# EAGLE design EM7SEGClk (EAGLE 9.0.1)
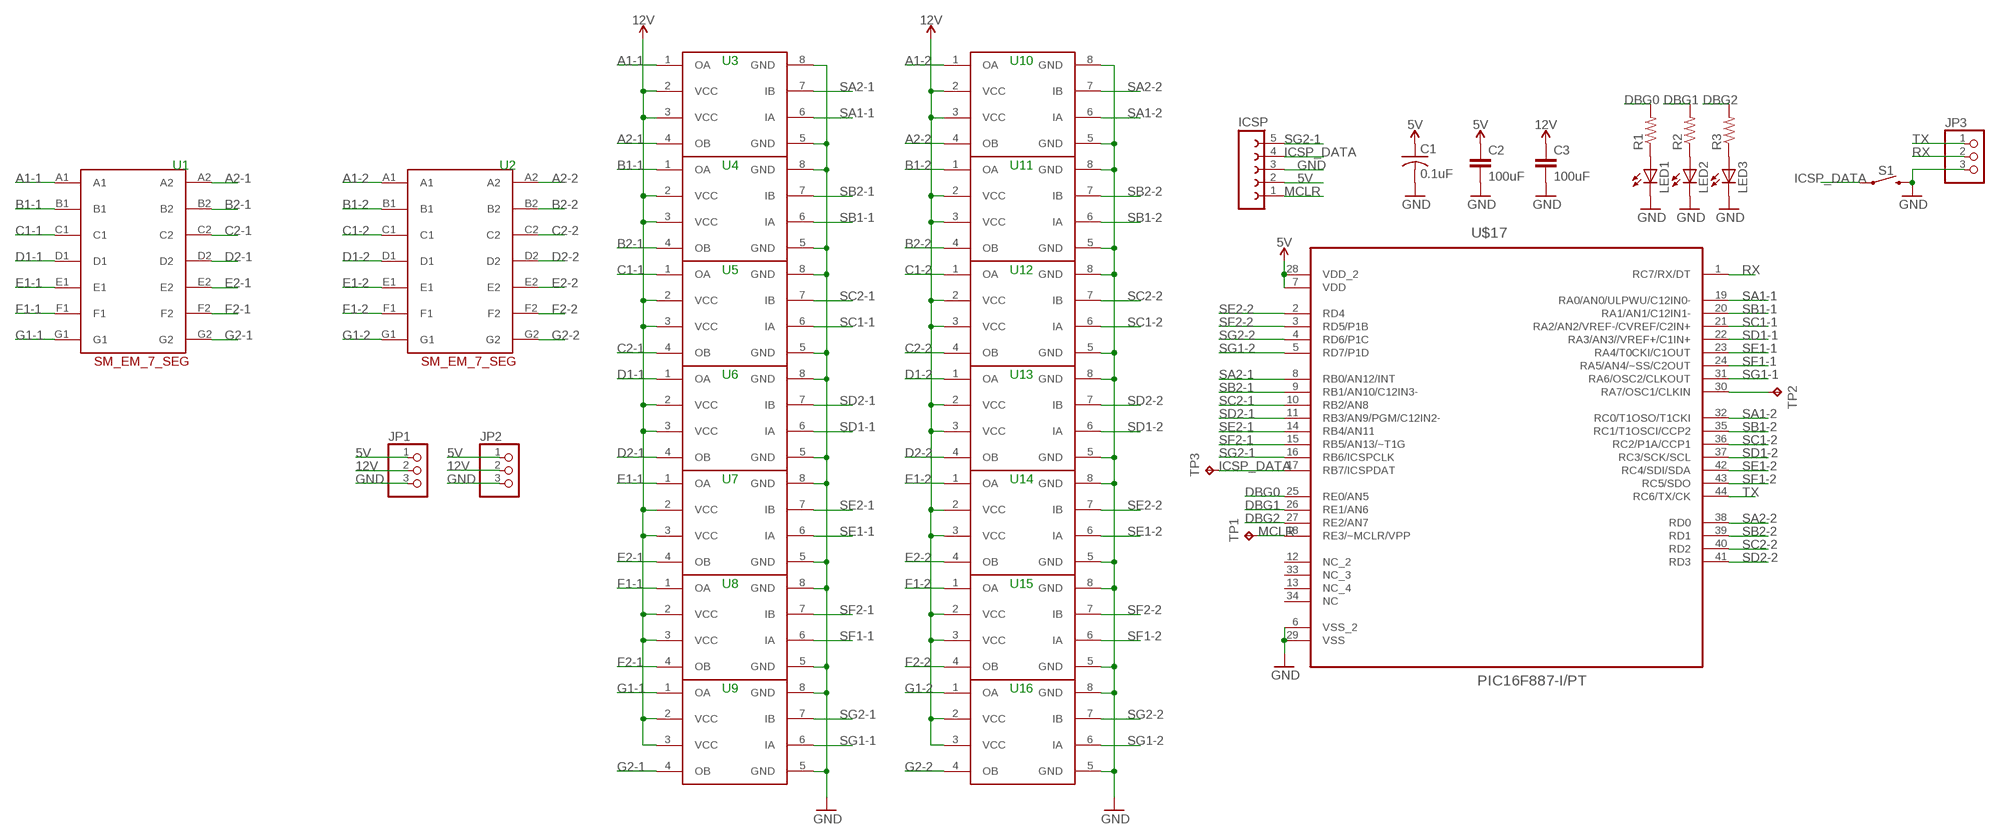
[diagram p0: schematic, sheet 1]

## Parts
C1  0.1uF  C-USC0805  [C0805]
C2  100uF  C5/2.5  [C5B2.5]
C3  100uF  C5/2.5  [C5B2.5]
ICSP  FE05-1  [FE05-1]
JP1  PINHD-1X3CB  [1X03-CLEANBIG]
JP2  PINHD-1X3CB  [1X03-CLEANBIG]
JP3  PINHD-1X3CB  [1X03-CLEANBIG]
LED1  LEDCHIPLED_0805  [CHIPLED_0805]
LED2  LEDCHIPLED_0805  [CHIPLED_0805]
LED3  LEDCHIPLED_0805  [CHIPLED_0805]
R1  R-US_M0805  [M0805]
R2  R-US_M0805  [M0805]
R3  R-US_M0805  [M0805]
S1  MOMENTARY-SWITCH-SPST-PTH-6.0MM  [TACTILE_SWITCH_PTH_6.0MM]
TP1  TPTP16R  [TP16R]
TP2  TPTP16R  [TP16R]
TP3  TPTP16R  [TP16R]
U$1  ELECTROMECHANICAL_7_SEG  [EM_7_SEG]
U$2  ELECTROMECHANICAL_7_SEG  [EM_7_SEG]
U$3  L9110SOP8  [SO8]
U$4  L9110SOP8  [SO8]
U$5  L9110SOP8  [SO8]
U$6  L9110SOP8  [SO8]
U$7  L9110SOP8  [SO8]
U$8  L9110SOP8  [SO8]
U$9  L9110SOP8  [SO8]
U$10  L9110SOP8  [SO8]
U$14  L9110SOP8  [SO8]
U$15  L9110SOP8  [SO8]
U$16  L9110SOP8  [SO8]
U$17  PIC16F887-I/PT  [QFP80P1200X1200X120-44N]
U$140  L9110SOP8  [SO8]
U$150  L9110SOP8  [SO8]
U$160  L9110SOP8  [SO8]

## Nets
5V: C1.1 C2.1 ICSP.2 JP1.1 JP2.1 U$17.7(VDD) U$17.28(VDD_2)
12V: C3.1 JP1.2 JP2.2 U$3.2(VCC) U$3.3(VCC) U$4.2(VCC) U$4.3(VCC) U$5.2(VCC) U$5.3(VCC) U$6.2(VCC) U$6.3(VCC) U$7.2(VCC) U$7.3(VCC) U$8.2(VCC) U$8.3(VCC) U$9.2(VCC) U$9.3(VCC) U$10.2(VCC) U$10.3(VCC) U$14.2(VCC) U$14.3(VCC) U$15.2(VCC) U$15.3(VCC) U$16.2(VCC) U$16.3(VCC) U$140.2(VCC) U$140.3(VCC) U$150.2(VCC) U$150.3(VCC) U$160.2(VCC) U$160.3(VCC)
A1-1: U$1.A1 U$3.1(OA)
A1-2: U$2.A1 U$10.1(OA)
A2-1: U$1.A2 U$3.4(OB)
A2-2: U$2.A2 U$10.4(OB)
B1-1: U$1.B1 U$4.1(OA)
B1-2: U$2.B1 U$140.1(OA)
B2-1: U$1.B2 U$4.4(OB)
B2-2: U$2.B2 U$140.4(OB)
C1-1: U$1.C1 U$5.1(OA)
C1-2: U$2.C1 U$150.1(OA)
C2-1: U$1.C2 U$5.4(OB)
C2-2: U$2.C2 U$150.4(OB)
D1-1: U$1.D1 U$6.1(OA)
D1-2: U$2.D1 U$160.1(OA)
D2-1: U$1.D2 U$6.4(OB)
D2-2: U$2.D2 U$160.4(OB)
DBG0: R1.2 U$17.25(RE0/AN5)
DBG1: R2.2 U$17.26(RE1/AN6)
DBG2: R3.2 U$17.27(RE2/AN7)
E1-1: U$1.E1 U$7.1(OA)
E1-2: U$2.E1 U$14.1(OA)
E2-1: U$1.E2 U$7.4(OB)
E2-2: U$2.E2 U$14.4(OB)
F1-1: U$1.F1 U$8.1(OA)
F1-2: U$2.F1 U$15.1(OA)
F2-1: U$1.F2 U$8.4(OB)
F2-2: U$2.F2 U$15.4(OB)
G1-1: U$1.G1 U$9.1(OA)
G1-2: U$2.G1 U$16.1(OA)
G2-1: U$1.G2 U$9.4(OB)
G2-2: U$2.G2 U$16.4(OB)
GND: C1.2 C2.2 C3.2 ICSP.3 JP1.3 JP2.3 JP3.3 LED1.C LED2.C LED3.C S1.3 U$3.5(GND) U$3.8(GND) U$4.5(GND) U$4.8(GND) U$5.5(GND) U$5.8(GND) U$6.5(GND) U$6.8(GND) U$7.5(GND) U$7.8(GND) U$8.5(GND) U$8.8(GND) U$9.5(GND) U$9.8(GND) U$10.5(GND) U$10.8(GND) U$14.5(GND) U$14.8(GND) U$15.5(GND) U$15.8(GND) U$16.5(GND) U$16.8(GND) U$17.6(VSS_2) U$17.29(VSS) U$140.5(GND) U$140.8(GND) U$150.5(GND) U$150.8(GND) U$160.5(GND) U$160.8(GND)
ICSP_DATA: ICSP.4 S1.1 TP3.TP U$17.17(RB7/ICSPDAT)
MCLR: ICSP.1 TP1.TP U$17.18(RE3/~MCLR/VPP)
N$1: LED1.A R1.1
N$2: LED2.A R2.1
N$3: LED3.A R3.1
N$4: TP2.TP U$17.30(RA7/OSC1/CLKIN)
RX: JP3.2 U$17.1(RC7/RX/DT)
SA1-1: U$3.6(IA) U$17.19(RA0/AN0/ULPWU/C12IN0-)
SA1-2: U$10.6(IA) U$17.32(RC0/T1OSO/T1CKI)
SA2-1: U$3.7(IB) U$17.8(RB0/AN12/INT)
SA2-2: U$10.7(IB) U$17.38(RD0)
SB1-1: U$4.6(IA) U$17.20(RA1/AN1/C12IN1-)
SB1-2: U$17.35(RC1/T1OSCI/CCP2) U$140.6(IA)
SB2-1: U$4.7(IB) U$17.9(RB1/AN10/C12IN3-)
SB2-2: U$17.39(RD1) U$140.7(IB)
SC1-1: U$5.6(IA) U$17.21(RA2/AN2/VREF-/CVREF/C2IN+)
SC1-2: U$17.36(RC2/P1A/CCP1) U$150.6(IA)
SC2-1: U$5.7(IB) U$17.10(RB2/AN8)
SC2-2: U$17.40(RD2) U$150.7(IB)
SD1-1: U$6.6(IA) U$17.22(RA3/AN3//VREF+/C1IN+)
SD1-2: U$17.37(RC3/SCK/SCL) U$160.6(IA)
SD2-1: U$6.7(IB) U$17.11(RB3/AN9/PGM/C12IN2-)
SD2-2: U$17.41(RD3) U$160.7(IB)
SE1-1: U$7.6(IA) U$17.23(RA4/T0CKI/C1OUT)
SE1-2: U$14.6(IA) U$17.42(RC4/SDI/SDA)
SE2-1: U$7.7(IB) U$17.14(RB4/AN11)
SE2-2: U$14.7(IB) U$17.2(RD4)
SF1-1: U$8.6(IA) U$17.24(RA5/AN4/~SS/C2OUT)
SF1-2: U$15.6(IA) U$17.43(RC5/SDO)
SF2-1: U$8.7(IB) U$17.15(RB5/AN13/~T1G)
SF2-2: U$15.7(IB) U$17.3(RD5/P1B)
SG1-1: U$9.6(IA) U$17.31(RA6/OSC2/CLKOUT)
SG1-2: U$16.6(IA) U$17.5(RD7/P1D)
SG2-1: ICSP.5 U$9.7(IB) U$17.16(RB6/ICSPCLK)
SG2-2: U$16.7(IB) U$17.4(RD6/P1C)
TX: JP3.1 U$17.44(RC6/TX/CK)
Unconnected: U$17.12(NC_2) U$17.13(NC_4) U$17.33(NC_3) U$17.34(NC)

## Notes on the sheet
- U3 | U10
- U1 | U2 | U4 | U11
- U5 | U12
- U6 | U13
- U7 | U14
- U8 | U15
- U9 | U16

## Library data of the parts
C1 = adafruit:C-US: CAPACITOR, American symbol
C2 C3 = capacitor-wima:C: CAPACITOR naming: grid - package width
ICSP = con-lsta:FE05-1: FEMALE HEADER; OC_FARNELL: unknown; OC_NEWARK: unknown
JP1-JP3 = adafruit:PINHD-1X3: PIN HEADER
LED1-LED3 = adafruit:LED: LED OSRAM: - CHIPLED LG R971, LG N971, LY N971, LG Q971, LY Q971, LO R971, LY R971 LH N974, LH R974 LS Q976, LO Q976, LY Q976 LO Q996 - Hyper CHIPLED LW Q18S LB Q993, LB Q99A, LB R99A - SideLED LS A670, LO A670, LY A670, LG A670, LP A670 LB A673, LV A673, LT A673, LW A673 LH A674 LY A675 LS A676, LA A676, LO A676, LY A676, LW A676 LS A679, LY A679, LG A679 - Hyper Micro SIDELED® LS Y876, LA Y876, LO Y876, LY Y876 LT Y87S - SmartLED LW L88C, LW L88S LB L89C, LB L89S, LG L890 LS L89K, LO L89K, LY L89K LS L896, LA L896, LO L896, LY L896 - TOPLED LS T670, LO T670, LY T670, LG T670, LP T670 LSG T670, LSP T670, LSY T670, LOP T670, LYG T670 LG T671, LOG T671, LSG T671 LB T673, LV T673, LT T673, LW T673 LH T674 LS T676, LA T676, LO T676, LY T676, LB T676, LH T676, LSB T676, LW T676 LB T67C, LV T67C, LT T67C, LS T67K, LO T67K, LY T67K, LW E67C LS E67B, LA E67B, LO E67B, LY E67B, LB E67C, LV E67C, LT E67C LW T67C LS T679, LY T679, LG T679 LS T770, LO T770, LY T770, LG T770, LP T770 LB T773, LV T773, LT T773, LW T773 LH T774 LS E675, LA E675, LY E675, LS T675 LS T776, LA T776, LO T776, LY T776, LB T776 LHGB T686 LT T68C, LB T68C - Hyper Mini TOPLED® LB M676 - Mini TOPLED Santana® LG M470 LS M47K, LO M47K, LY M47K Source: http://www.osram.convergy.de/
R1-R3 = adafruit:R-US_: RESISTOR, American symbol
S1 = SparkFun-Switches:MOMENTARY-SWITCH-SPST: Momentary Switch (Pushbutton) - SPST Normally-open (NO) SPST momentary switches (buttons, pushbuttons). Variants PTH-12MM - 12mm square, through-hole Momentary Pushbutton Switch - 12mm Square <https://www.sparkfun.com/products/9190> (COM-09190) PTH-6.0MM, PTH-6.0MM-KIT - 6.0mm square, through-hole Mini Pushbutton Switch <https://www.sparkfun.com/products/97> (COM-00097) KIT package intended for soldering kit's - only one side of pads' copper is exposed. PTH-RIGHT-ANGLE-KIT - Right-angle, through-hole Right Angle Tactile Button <https://www.sparkfun.com/products/10791> - Used on SparkFun BigTime Watch Kit <https://www.sparkfun.com/products/11734> SMD-12MM - 12mm square, surface-mount Tactile Button - SMD (12mm) <https://www.sparkfun.com/products/12993> (COM-12993) Used on SparkFun PicoBoard <https://www.sparkfun.com/products/11888> SMD-4.5MM - 4.5mm Square Trackball Switch Used on SparkFun Blackberry Trackballer Breakout <https://www.sparkfun.com/products/13169> SMD-4.6MMX2.8MM - 4.60mm x 2.80mm, surface mount Used on SparkFun SAMD21 Mini Breakout <https://www.sparkfun.com/products/13664> SMD-5.2MM, SMD-5.2-REDUNDANT - 5.2mm square, surface-mount Mini Pushbutton Switch - SMD <https://www.sparkfun.com/products/8720> (COM-08720) Used on Arduino Pro Mini <https://www.sparkfun.com/products/11114> REDUNDANT package connects both switch circuits together SMD-6.0X3.5MM - 6.0 x 3.5mm, surface mount Momentary Reset Switch SMD <https://www.sparkfun.com/products/8229> (COM-08229) SMD-6.2MM-TALL - 6.2mm square, surface mount Tactile Button - SMD (6mm) <https://www.sparkfun.com/products/12992> Used on SparkFun Digital Sandbox <https://www.sparkfun.com/products/12651> SMD-RIGHT-ANGLE - Right-angle, surface mount Used on SparkFun Block for Intel® Edison - Arduino <https://www.sparkfun.com/products/13036>; PROD_ID: SWCH-08441; SF_SKU: COM-00097
TP1-TP3 = BeagleBone_Blue_R3:TP: Test pad
U$1 U$2 = sjm4306-custom:ELECTROMECHANICAL_7_SEG
U$3-U$10 U$14-U$16 U$140 U$150 U$160 = sjm4306-custom:L9110
U$17 = Microchip_By_element14_Batch_1:PIC16F887-I/PT: 8-Bit CMOS Microcontrollers; MPN: PIC16F887-I/PT; OC_FARNELL: 1439542; OC_NEWARK: 74K8587; PACKAGE: QFP-44; SUPPLIER: Microchip

## Board
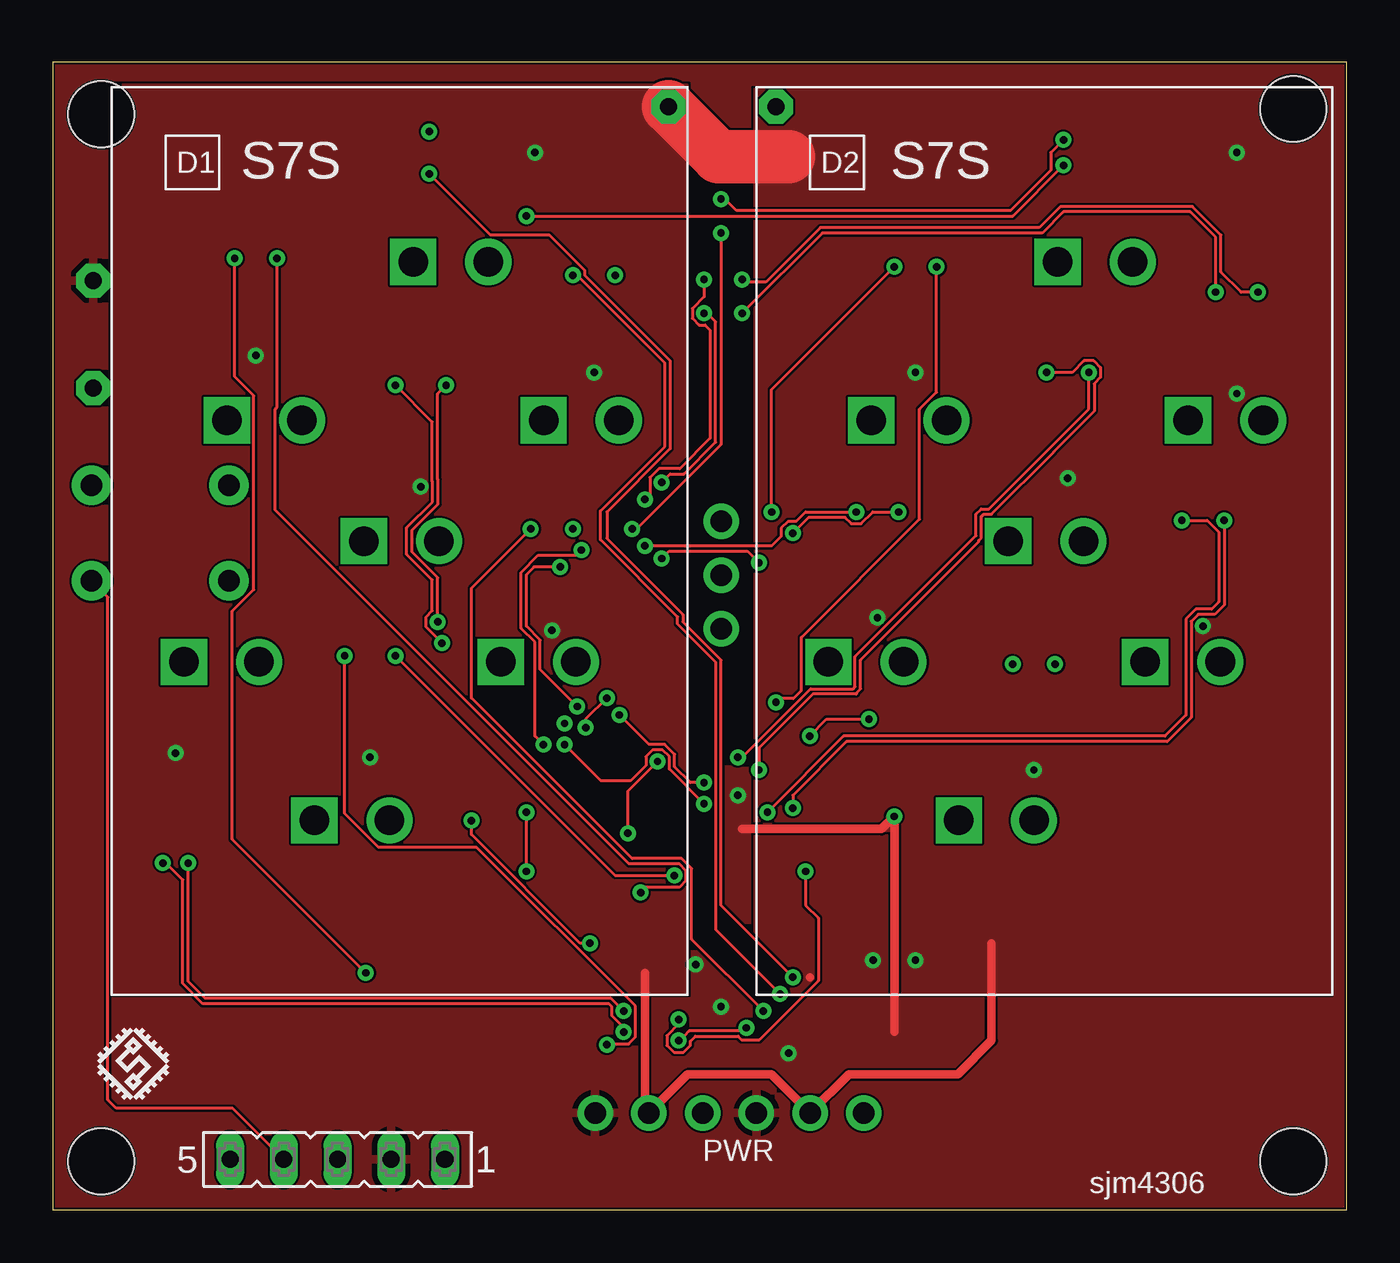
[diagram p1: board, top side]
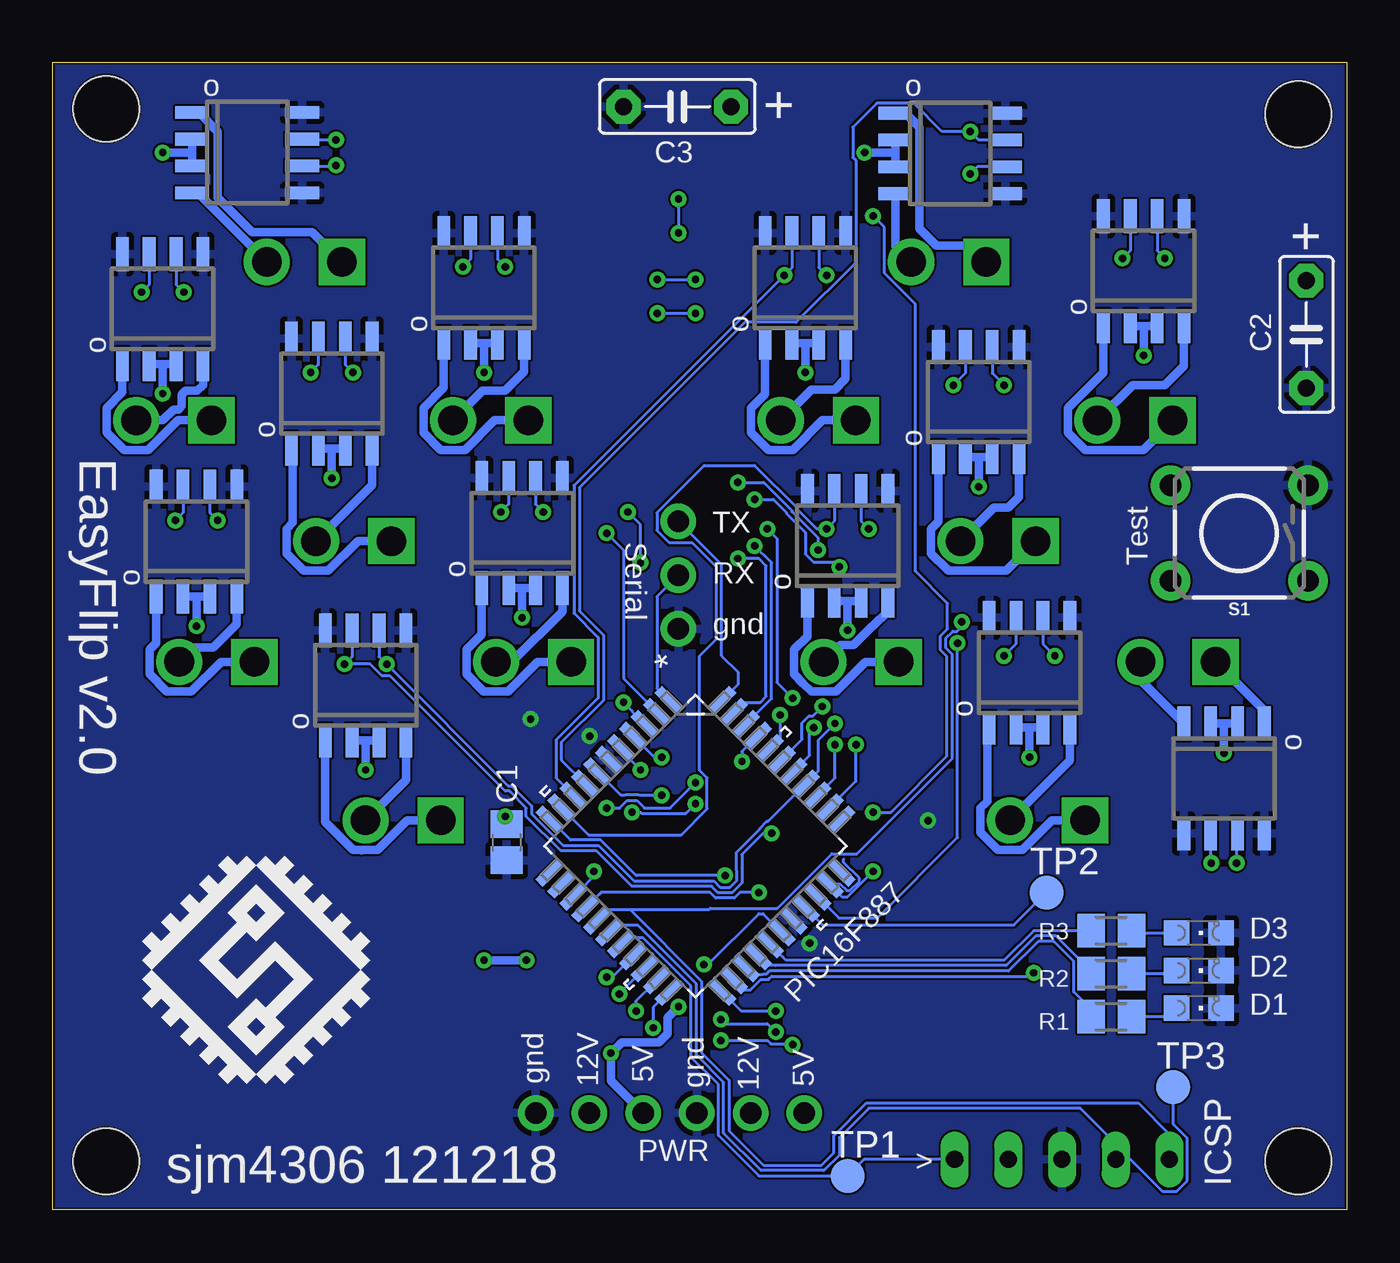
[diagram p2: board, bottom side, seen from below]

Size 61.19 x 54.28 mm. Coordinates in mm from the lower left corner, seen from the top.
Outline: 0,0 61.19,0 61.19,54.28 0,54.28 0,0
Copper layers (1*16): Top 0.035mm / dielectric 1.5mm / Bottom 0.035mm
Design rules "default *": minimum track width 6mil, minimum drill 0.35mm, track to track 4mil, track to pad 4mil, pad to pad 4mil, via to via 4mil, smd to smd 4mil, copper to edge 4mil, drill to drill 6mil, minimum pad ring 10mil, minimum via ring 8mil, stop-mask expansion 4mil, vias tented up to drill 15mil, thermal gap 10mil
Holes 3.1 mm at 58.67,52.07 2.29,51.82 58.67,2.29 2.29,2.29

### Footprints (pad centres in the part's own frame; a part is rotated, then mirrored left to right if it is on the bottom)
C0805 = smd 1.3 x 1.5: 1 -0.85,0; 2 0.85,0
C5B2.5 = drill 0.813 pad 1.6 octagon: 1 -2.54,0; 2 2.54,0
FE05-1 = drill 0.813 long: 1 -5.08,0; 2 -2.54,0; 3 0,0; 4 2.54,0; 5 5.08,0
1X03-CLEANBIG = drill 1.016 pad 1.676: 1 -2.54,0; 2 0,0; 3 2.54,0
CHIPLED_0805 = smd 1.2 x 1.2: A 0,-1.05; C 0,1.05
M0805 = smd 1.3 x 1.6: 1 -0.95,0; 2 0.95,0
TACTILE_SWITCH_PTH_6.0MM = drill 1.016 pad 1.88: 1 -3.251,2.261; 2 3.251,2.261; 3 -3.251,-2.261; 4 3.251,-2.261
TP16R = smd 1.6 x 1.6: TP 0,0
EM_7_SEG = drill 1.397 pad 2.184 square: A1 14.249,34.671; B1 20.422,27.178; C1 18.39,15.748; D1 9.576,8.255; E1 3.404,15.748; F1 5.436,27.178; G1 11.913,21.463 | drill 1.397 pad 2.184: A2 17.805,34.671; B2 23.978,27.178; C2 21.946,15.748; D2 13.132,8.255; E2 6.96,15.748; F2 8.992,27.178; G2 15.469,21.463
SO8 = smd 0.6 x 1.6: 1 -1.905,-2.6; 2 -0.635,-2.6; 3 0.635,-2.6; 4 1.905,-2.6; 5 1.905,2.6; 6 0.635,2.6; 7 -0.635,2.6; 8 -1.905,2.6
QFP80P1200X1200X120-44N = smd 1.473 x 0.483: 1 -5.74,3.988; 2 -5.74,3.2; 3 -5.74,2.388; 4 -5.74,1.6; 5 -5.74,0.787; 6 -5.74,0; 7 -5.74,-0.787; 8 -5.74,-1.6; 9 -5.74,-2.388; 10 -5.74,-3.2; 11 -5.74,-3.988; 23 5.74,-3.988; 24 5.74,-3.2; 25 5.74,-2.388; 26 5.74,-1.6; 27 5.74,-0.787; 28 5.74,0; 29 5.74,0.787; 30 5.74,1.6; 31 5.74,2.388; 32 5.74,3.2; 33 5.74,3.988 | smd 0.483 x 1.473: 12 -3.988,-5.74; 13 -3.2,-5.74; 14 -2.388,-5.74; 15 -1.6,-5.74; 16 -0.787,-5.74; 17 0,-5.74; 18 0.787,-5.74; 19 1.6,-5.74; 20 2.388,-5.74; 21 3.2,-5.74; 22 3.988,-5.74; 34 3.988,5.74; 35 3.2,5.74; 36 2.388,5.74; 37 1.6,5.74; 38 0.787,5.74; 39 0,5.74; 40 -0.787,5.74; 41 -1.6,5.74; 42 -2.388,5.74; 43 -3.2,5.74; 44 -3.988,5.74

### Placement (x,y rotation side)
C1  39.73,17.37 270 bottom
C2  1.9,41.4 270 bottom
C3  31.66,52.18 180 bottom
ICSP  13.46,2.38 180 top
JP1  35.81,4.57 0 top
JP2  28.19,4.57 0 top
JP3  31.6,30.01 270 top
LED1  7,9.53 270 bottom
LED2  7,11.31 270 bottom
LED3  7,13.09 270 bottom
R1  11.13,9.13 180 bottom
R2  11.13,11.17 180 bottom
R3  11.13,13.2 180 bottom
S1  5.08,32 180 bottom
TP1  23.6,1.6 0 bottom
TP2  14.2,15 0 bottom
TP3  8.2,5.8 0 bottom
U$1  2.79,10.16 0 top
U$2  33.27,10.16 0 top
U$3  18.75,49.96 270 bottom
U$4  25.6,43.6 0 bottom
U$5  23.6,31.4 0 bottom
U$6  15,25.4 0 bottom
U$7  5.8,20.4 180 bottom
U$8  9.6,44.4 0 bottom
U$9  17.4,38.2 0 bottom
U$10  52,50 270 bottom
U$11  [SJM4306_LOGO_MEDIUM]  51.28,11.33 0 bottom
U$13  [SJM4306_LOGO_SMALL]  3.81,6.86 0 top
U$14  39,32 0 bottom
U$15  40.8,43.6 0 bottom
U$16  48,38.6 0 bottom
U$17  30.8,17.2 315 bottom
U$140  56,42.6 0 bottom
U$150  54.4,31.6 0 bottom
U$160  46.4,24.8 0 bottom

### Tracks (layer width: path | path; a pad name or v marks a point on that pad's centre or on a via)
5V  (via drill 0.35)
  Top 0.406: 32.6,18 39.2,18 v39.8,18.6 39.8,8.4
  Bottom 0.152: U$17.28 27.6,14 27.8,14 30.2,11.6 v30.4,11.6 | C1.1 39.8,18.29 v39.8,18.6 | U$17.28 | v32.4,19.6 33.45,19.6 33.46,19.61 34.14,19.61 34.15,19.6 34.31,19.6 34.36,19.64 | 34.36,19.64 U$17.7 34.36,19.64 | 34.36,19.64
  Bottom 0.406: JP1.1 34.8,6.1 v34.8,7.4 34.28,7.92 32.52,7.92 32.12,8.32 32.12,9.08 v31.6,9.6
  pour Top (rank 2): -3.56,-3.81 -3.56,59.69 66.29,59.69 66.29,-3.81
12V  (via drill 0.35)
  Top 0.406: 35.81,10.99 35.8,11 | 28,11.2 28,4.77 JP2.2 30.02,6.4 33.99,6.4 JP1.2 37.64,6.4 42.8,6.4 44.4,8 44.4,12.6
  Top 2.54: C3.1 31.49,49.8 34.8,49.8
  Bottom 0.406: U$7.2 5.8,23 | 5.8,23 U$7.3 | 5.8,23 v5.8,21.6 | U$6.2 15,22.8 | 15,22.8 U$6.3 | 15,22.8 v15,21.4 | U$3.2 21.35,50 | 21.35,50 U$3.3 | U$10.2 54.6,50 | 54.6,50 U$10.3 | 54.6,50 v56,50 | U$15.2 40.8,41 | 40.8,41 U$15.3 | v40.8,39.6 40.8,41 | U$140.3 56,40 | 56,40 U$140.2 | v56,38.6 56,40 | U$16.2 48,36 | 48,36 U$16.3 | v48,34.6 48,36 | U$150.2 54.4,29 | 54.4,29 U$150.3 | v54.4,27.6 54.4,29 | U$14.2 39,29.4 | 39,29.4 U$14.3 | v39,28 39,29.4 | U$160.2 46.4,22.2 | 46.4,22.2 U$160.3 | v46.4,20.8 46.4,22.2 | U$5.2 23.6,28.8 | 23.6,28.8 U$5.3 | v23.6,27.4 23.6,28.8 | U$8.2 9.6,41.8 | 9.6,41.8 U$8.3 | v9.6,40.4 9.6,41.8 | v22.8,50 21.35,50 | U$4.3 25.6,41 | 25.6,41 U$4.2 | v25.6,39.6 25.6,41 | U$9.2 17.4,35.6 | 17.4,35.6 U$9.3 | v17.4,34.2 17.4,35.6 | v38.8,11.8 v40.8,11.8
  pour Top: 2.8,10.4 2.8,53.2 30,53.2 30,10.2 2.8,10.2
  pour Top: 33.2,10.2 33.2,53 60.4,53 60.4,10.2 60,10.2
A1-1
  Bottom 0.406: U$1.A1 17.81,45.6 19.39,45.6 20.2,46.41 20.2,51.2 20.86,51.87 U$3.1
A1-2
  Bottom 0.406: U$2.A1 48.92,46.23 51.76,46.23 53.4,47.87 53.4,51 54.3,51.91 U$10.1
A2-1
  Bottom 0.406: U$1.A2 21.35,45.58 U$3.4
A2-2
  Bottom 0.406: U$2.A2 54.34,48.09 U$10.4
B1-1
  Bottom 0.406: U$1.B1 24.8,37.34 26.19,35.94 27.35,35.94 28.17,36.76 28.17,37.92 27.5,38.58 U$4.1
B1-2
  Bottom 0.406: U$140.1 57.91,38.66 58.65,37.92 58.65,36.76 57.83,35.94 56.67,35.94 55.28,37.34 U$2.B1
B2-1
  Bottom 0.406: U$1.B2 25.31,38.8 24.2,38.8 23.7,39.3 U$4.4
B2-2
  Bottom 0.406: U$2.B2 55.99,37.34 55.49,37.85 55.25,37.85 55.09,38 55.09,38.56 54.91,38.73 54.36,38.73 54.09,39 U$140.4
C1-1
  Bottom 0.406: U$1.C1 22.76,25.91 24.16,24.51 25.32,24.51 25.7,24.9 26.14,25.33 26.14,26.49 25.5,27.12 U$5.1
C1-2
  Bottom 0.406: U$2.C1 53.24,25.91 54.64,24.51 55.8,24.51 56.62,25.33 56.62,26.49 56.3,26.8 U$150.1
C2-1
  Bottom 0.406: U$1.C2 23.93,26.72 23.32,26.72 22.43,27.6 22.4,27.6 21.7,28.3 U$5.4
C2-2
  Bottom 0.406: U$2.C2 54.53,26.6 53.6,26.6 52.49,27.7 U$150.4
D1-1
  Bottom 0.406: U$1.D1 13.95,18.41 15.35,17.02 16.5,17.02 17.32,17.84 17.32,18.99 17,19.32 17,22.7 U$6.1
D1-2
  Bottom 0.406: U$2.D1 44.43,18.41 45.83,17.02 46.58,17.02 46.6,17 46.62,17.02 46.98,17.02 48.3,18.34 U$160.1
D2-1
  Bottom 0.406: U$1.D2 13.1,21.25 U$6.4
D2-2
  Bottom 0.406: U$2.D2 44.49,20.33 U$160.4
DBG0
  Bottom 0.152: R1.2 12.08,9.46 12.91,10.29 12.91,11.75 13.85,12.69 14.59,12.69 15.99,11.29 27.3,11.29 27.45,11.14 27.6,11.14 28,11.14 28.12,11.14 | 28.12,11.14 U$17.25 28.12,11.14 | 28.12,11.14
DBG1
  Bottom 0.152: R2.2 12.08,11.28 13.74,12.94 14.7,12.94 16.09,11.55 27,11.55 27.41,11.55 | 27.41,11.55 U$17.26 27.41,11.55 | 27.41,11.55
DBG2
  Bottom 0.152: R3.2 14.8,13.2 16.2,11.8 26.51,11.8 26.66,11.94 | 26.66,11.94 U$17.27 26.66,11.94 | 26.66,11.94
E1-1
  Bottom 0.406: U$7.1 3.9,23.61 U$1.E1
E1-2
  Bottom 0.406: U$2.E1 38.26,25.91 39.66,24.51 40.81,24.51 41.63,25.33 41.63,26.49 40.91,27.21 U$14.1
E2-1
  Bottom 0.406: U$7.4 9.75,25.05 U$1.E2
E2-2
  Bottom 0.406: U$2.E2 39.49,25.91 37.09,28.3 U$14.4
F1-1
  Bottom 0.406: U$1.F1 9.63,35.94 12.36,35.94 13.18,36.76 13.18,37.92 11.51,39.59 U$8.1
F1-2
  Bottom 0.406: U$2.F1 40.29,37.34 41.69,35.94 42.84,35.94 43.66,36.76 43.66,37.92 42.7,38.87 U$15.1
F2-1
  Bottom 0.406: U$1.F2 10.12,39 8.6,39 7.7,39.91 U$8.4
F2-2
  Bottom 0.406: U$2.F2 40.87,38.73 39.8,38.73 38.9,39.64 U$15.4
G1-1
  Bottom 0.406: U$1.G1 16.1,30.23 18.84,30.23 19.66,31.04 19.66,32.2 19.3,32.56 U$9.1
G1-2
  Bottom 0.406: U$2.G1 46.77,31.62 48.16,30.23 49.32,30.23 50.14,31.04 50.14,32.2 49.85,32.49 49.85,35.94 U$16.1
G2-1
  Bottom 0.406: U$1.G2 16.69,33.2 16,33.2 15.49,33.7 U$9.4
G2-2
  Bottom 0.406: U$2.G2 46.09,34.27 U$16.4
GND  (via drill 0.35)
  Top 0.152: v25.4,12.6 24.95,12.6 19.8,17.75 v19.8,18.4 | v35.8,22.4 36.6,23.2 v38.6,23.2
  pour Bottom: -2.29,-2.54 -2.29,57.15 63.75,57.15 63.75,-2.54
ICSP_DATA
  Top 0.152: ICSP.4 8.5,4.8 3,4.8 2.6,5.2 2.6,28.97 S1.1
  Bottom 0.152: 34.25,13.45 34.4,13.6 U$17.17 34.55,13.45 34.25,13.45 | 34.25,13.45 34,13.45 33.52,13.45 30.76,10.69 30.76,7.32 29.46,6.02 29.46,3.62 27.7,1.85 24.73,1.85 24,2.58 24,3.4 22.6,4.8 12.6,4.8 10.92,3.12 ICSP.4 10.23,2.38 8.73,0.88 8.04,0.88 7.54,1.37 7.54,3.39 8.2,4.04 TP3.TP
MCLR
  Bottom 0.152: 34.01,12.88 U$17.18 34.01,12.88 | 34.01,12.88 33.3,12.88 31.01,10.59 31.01,7.21 29.72,5.92 29.72,3.52 27.8,1.6 TP1.TP 22.82,2.38 ICSP.1 | 34.01,12.88
N$1
  Bottom 0.152: R1.1 8.45,9.13 LED1.A
N$2
  Bottom 0.152: R2.1 8.19,11.17 LED2.A
N$3
  Bottom 0.152: R3.1 10.07,13.09 LED3.A
N$4
  Bottom 0.152: U$17.30 24.8,13.46 15.74,13.46 TP2.TP | U$17.30
RX
  Bottom 0.152: JP3.2 32.62,29 32.62,24.66 U$17.1 | U$17.1
SA1-1  (via drill 0.35)
  Top 0.152: v35,11 31.61,14.39 31.61,25.99 29.8,27.8 29.8,28.15 26.2,31.75 26.2,33 29.2,36 29.2,40.16 25.16,44.2 25.16,44.43 23.48,46.1 20.7,46.1 v17.8,49
  Bottom 0.152: U$3.6 17.48,49.33 v17.8,49 | U$17.19 | v35,11 34.74,11 33.87,11.87 U$17.19 | U$17.19
SA1-2  (via drill 0.35)
  Top 0.152: v22.4,16 v22.4,18.8 | v22.4,47 45.4,47 v47.8,49.4
  Bottom 0.152: U$10.6 47.84,49.37 v47.8,49.4 | U$17.32 24.44,15.36 | 24.44,15.36 23.87,14.8 23.6,14.8 v22.4,16 | v22.4,18.8 21.56,18.8 18.91,21.45 18.91,26.16 19.21,26.46 19.21,27.14 18.87,27.47 18.87,28.67 20.4,30.2 20.4,42.84 21.87,44.3 21.87,46.47 v22.4,47 | U$17.32 24.44,15.36 | 24.44,15.36 | 23.8,16.58 23.8,16.43 23.05,15.68 23.05,15.54 23.5,15.09 23.64,15.09 23.96,15.4 U$17.32
SA2-1  (via drill 0.35)
  Bottom 0.152: U$3.7 17.39,50.59 v17.8,51 19.14,51 20.48,52.34 22.23,52.34 23.36,51.21 23.36,49.77 23.22,49.63 23.22,44.8 26.04,41.98 28.46,41.98 36.29,34.15 36.29,28.32 35.15,27.18 35.15,24.09 37.15,22.1 37.15,21.28 U$17.8 | U$17.8
SA2-2  (via drill 0.35)
  Top 0.152: v47.8,50.6 47.2,50 47.2,49.16 45.3,47.25 32.35,47.25 31.8,47.8 v31.6,47.8 | v31.6,46.2 31.6,36.2 27.6,32.2 v27.4,32.2 | v26.2,24.2 25.2,23.2 v25.2,22.8
  Bottom 0.152: U$10.7 49.37,50.6 v47.8,50.6 | 25.54,21.34 U$17.38 25.54,21.34 | 25.54,21.34 25.4,21.49 25.4,22.6 v25.2,22.8 | v31.6,47.8 v31.6,46.2 | v27.4,32.2 26.95,31.75 26.95,24.95 v26.2,24.2 | 25.54,21.34
SB1-1  (via drill 0.35)
  Top 0.152: v34.4,10.2 31.36,13.24 31.36,25.89 29.55,27.7 29.55,28.04 25.89,31.69 25.89,33.05 28.95,36.1 28.95,40.05 24.8,44.2 v24.6,44.2
  Bottom 0.152: U$4.6 24.96,44.56 v24.6,44.2 | v34.4,10.2 34.4,10.22 U$17.20 | U$17.20
SB1-2  (via drill 0.35)
  Top 0.152: v23.2,22 22.8,22.4 22.8,26.84 22.15,27.5 22.15,30.15 22.96,30.96 24.76,30.96 v25,31.2 | v55,43.4 55,46 53.8,47.2 47.8,47.2 46.8,46.2 36.4,46.2 v32.6,42.4 | v28.8,34.4 29.2,34.8 29.84,34.8 31.35,36.3 31.35,42 30.95,42.4 v30.8,42.4
  Bottom 0.152: U$140.6 55.37,43.77 v55,43.4 | v23.2,22 23.2,20.27 24.34,19.14 U$17.35 | v32.6,42.4 v30.8,42.4 | v28.8,34.4 27.56,34.4 26.24,33.08 26.24,33.02 25,31.78 v25,31.2 | U$17.35
SB2-1  (via drill 0.35)
  Bottom 0.152: U$4.7 26.23,44.56 v26.6,44.2 36.55,34.25 36.55,28.21 35.41,27.07 35.41,24.2 37.4,22.21 37.4,20.42 U$17.9 | U$17.9
SB2-2  (via drill 0.35)
  Top 0.152: v24.8,23.8 23.05,25.55 23.05,26.95 22.4,27.6 22.4,30.04 22.76,30.4 v24,30.4 | v57,43.4 56.2,43.4 55.25,44.35 55.25,46.1 53.91,47.45 47.65,47.45 46.65,46.45 36.3,46.45 33.72,43.88 32.72,43.88 v32.6,44 | v30.8,44 30.8,43.19 30.24,42.63 30.24,42.17 30.57,41.84 30.85,41.84 31.09,41.6 31.09,36.49 29.65,35.05 28.67,35.05 28.24,34.63 28.24,33.64 28.2,33.6 v28,33.6
  Bottom 0.152: U$140.7 56.63,43.77 v57,43.4 | v24.8,23.8 25.24,23.36 25.43,23.36 25.76,23.03 25.76,22.24 26.6,21.4 | 26.6,21.4 U$17.39 26.6,21.4 | v32.6,44 v30.8,44 | v28,33.6 27.12,33.6 26.49,32.97 26.49,32.92 25.6,32.02 25.6,31.01 25.23,30.64 24.24,30.64 v24,30.4 | 26.6,21.4
SC1-1  (via drill 0.35)
  Top 0.152: v33.6,9.4 30.21,12.79 30.21,16.14 29.74,16.61 27.4,16.61 19.81,24.2 19.8,24.2 19.8,29.4 v22.6,32.2
  Bottom 0.152: U$5.6 22.96,32.56 v22.6,32.2 | v33.6,9.4 33.6,9.87 32.74,10.74 | 32.74,10.74 U$17.21 32.74,10.74 | 32.74,10.74
SC1-2  (via drill 0.35)
  Top 0.152: v53.4,32.6 54.6,32.6 55.15,32.05 55.15,28.75 54.81,28.41 54.06,28.41 53.59,27.94 53.59,23.39 52.6,22.4 37.4,22.4 v33.8,18.8 | v30.8,19.2 29.16,20.84 29.16,21.43 28.83,21.76 28.37,21.76 28.04,21.43 28.04,21 27.32,20.28 25.92,20.28 v24.2,22
  Bottom 0.152: U$150.6 53.77,32.97 v53.4,32.6 | v24.2,22 24.2,20.42 25.01,19.61 U$17.36 | v33.8,18.8 33.4,18.8 33.35,18.75 31.25,18.75 v30.8,19.2 | U$17.36
SC2-1  (via drill 0.35)
  Bottom 0.152: U$5.7 24.23,32.56 v24.6,32.2 25.06,32.2 25.98,33.13 25.98,33.18 28,35.2 30.39,35.2 32.62,32.97 32.62,32.13 32.02,31.54 30.95,31.54 29.82,30.4 29.82,26.98 30.6,26.2 30.6,20.79 30.24,20.43 30.24,18.96 31.47,17.73 35.86,17.73 37.06,18.94 | 37.06,18.94 U$17.10 37.06,18.94 | 37.06,18.94
SC2-2  (via drill 0.35)
  Top 0.152: v55.4,32.6 55.4,28.6 54.96,28.16 54.17,28.16 53.84,27.83 53.84,23.29 52.7,22.15 37.55,22.15 35,19.6 v35,19 | v30.8,20.2 30.16,20.2 29.41,20.95 29.41,21.54 28.94,22.01 28.19,22.01 v26.8,23.4
  Bottom 0.152: U$150.7 55.03,32.97 v55.4,32.6 | v35,19 34.39,19 34.03,19.36 33.57,19.36 33.21,19 32,19 v30.8,20.2 | v26.8,23.4 26.8,22.31 27.16,21.96 | 27.16,21.96 U$17.40 27.16,21.96 | 27.16,21.96
SD1-1  (via drill 0.35)
  Top 0.152: v26.2,7.8 26.24,7.84 27.23,7.84 27.56,8.17 27.56,9.63 20.04,17.14 15.4,17.14 13.8,18.75 v13.8,26.2 | v32.8,8.6 32.65,8.45 30.09,8.45 29.84,8.2 v29.6,8
  Bottom 0.152: U$6.6 14.37,26.77 v13.8,26.2 | U$17.22 32.8,9.56 v32.8,8.6 | v26.2,7.8 26.24,7.84 27.23,7.84 27.39,8 v29.6,8 | U$17.22
SD1-2  (via drill 0.35)
  Bottom 0.152: U$160.6 45.77,26.16 v45.4,25.8 39.65,20.05 39.49,20.05 38.55,19.11 38.55,18.72 37.06,17.23 35.38,17.23 33.7,15.55 29.93,15.55 29.63,15.24 29.17,15.24 28.84,15.57 28.84,16.03 28.85,16.04 28.85,16.91 27.76,18 27.76,18.03 27.43,18.36 27.38,18.36 25,20.74 | v24.2,23 25,22.2 25,20.74 | U$17.37 25,20.74 | 25,20.74
SD2-1  (via drill 0.35)
  Top 0.152: v16.2,26.2 26.6,15.8 v29.4,15.8
  Bottom 0.152: U$6.7 15.63,26.77 v16.2,26.2 | v29.4,15.8 33.6,15.8 35.28,17.48 36.72,17.48 37.62,18.38 | 37.62,18.38 U$17.11 37.62,18.38 | 37.62,18.38
SD2-2  (via drill 0.35)
  Top 0.152: v27.2,17.8 27.2,19.8 v28.6,21.2
  Bottom 0.152: U$160.7 47.03,26.16 v47.4,25.8 46.19,25.8 45.63,25.24 45.24,25.24 39.8,19.8 39.6,19.8 38.8,19 38.8,18.61 37.16,16.97 35.49,16.97 33.81,15.29 30.04,15.29 29.74,14.99 29.06,14.99 28.59,15.46 28.59,16.14 28.6,16.15 28.6,16.8 27.6,17.8 v27.2,17.8 | U$17.41 28.6,21.66 v28.6,21.2 | U$17.41
SE1-1  (via drill 0.35)
  Top 0.152: v6.4,16.4 6.4,10.8 7.2,10 26.4,10 v27,9.4
  Bottom 0.152: v27,9.4 28.64,9.4 28.82,9.58 U$17.23 | v6.4,16.4 6.43,16.43 U$7.6 | U$17.23
SE1-2  (via drill 0.35)
  Top 0.152: v38,33 35.6,33 35.16,32.56 34.77,32.56 34.44,32.23 34.44,31.84 34,31.4 v28,31.4
  Bottom 0.152: U$14.6 38.37,33.37 v38,33 | 28.39,22.99 U$17.42 28.39,22.99 | 28.39,22.99 27.2,24.18 27.2,30.6 v28,31.4 | 28.39,22.99
SE2-1  (via drill 0.35)
  Top 0.152: v27,8.4 27,8.61 26.44,9.17 26.44,9.6 26.3,9.75 7.09,9.75 6.15,10.7 6.15,15.6 5.35,16.4 v5.2,16.4 | v35.6,16 35.6,14.4 36.2,13.8 36.2,10.83 33.41,8.04 32.57,8.04 32.41,8.2 30.39,8.2 30.16,7.97 30.16,7.77 29.83,7.44 29.37,7.44 29.04,7.77 29.04,8.23 29.6,8.79 v29.6,9
  Bottom 0.152: 36.29,15.09 U$17.14 36.29,15.09 | 36.29,15.09 35.6,15.78 v35.6,16 | v5.2,16.4 5.2,17.77 U$7.7 | v27,8.4 27.4,8.8 29.4,8.8 v29.6,9 | 36.29,15.09
SE2-2  (via drill 0.35)
  Top 0.152: v40,33 38.79,33 38.23,32.44 37.77,32.44 37.47,32.75 35.75,32.75 v35,32
  Bottom 0.152: U$14.7 39.63,33.37 v40,33 | v35,32 34.2,31.2 34.2,25.13 33.24,24.16 U$17.2 | U$17.2 | U$17.2
SF1-1  (via drill 0.35)
  Top 0.152: v8.6,45 8.6,39.4 9.5,38.5 9.5,29.33 8.48,28.32 8.48,17.52 v14.8,11.2
  Bottom 0.152: U$8.6 8.96,45.37 v8.6,45 | U$17.24 28.53,10.4 28.19,10.4 27.7,10.89 27.34,10.89 27.19,11.04 14.96,11.04 v14.8,11.2 | U$17.24
SF1-2  (via drill 0.35)
  Top 0.152: v28.8,30.8 29.15,31.15 32.85,31.15 v33.4,30.6 | v34,33 34,38.8 v39.8,44.6
  Bottom 0.152: U$15.6 40.16,44.97 v39.8,44.6 | 28.86,23.66 U$17.43 28.86,23.66 | 28.86,23.66 28.53,24 27.74,24 27.45,24.28 27.45,30.45 27.8,30.8 v28.8,30.8 | v33.4,30.6 33.4,32.4 v34,33 | 28.86,23.66
SF2-1  (via drill 0.35)
  Top 0.152: v10.6,45 10.6,37.95 10.52,37.86 10.52,33.08 27.24,16.36 29.63,16.36 29.96,16.03 29.96,15.57 29.63,15.24 28.04,15.24 v27.8,15
  Bottom 0.152: U$8.7 10.23,45.37 v10.6,45 | 35.33,14.93 35.26,15 30.11,15 29.84,14.74 28.96,14.74 28.7,15 v27.8,15 | 35.33,14.93 U$17.15 35.33,14.93 | 35.33,14.93
SF2-2  (via drill 0.35)
  Top 0.152: v41.8,44.6 41.8,38.67 41,37.86 41,32.66 35.41,27.07 35.41,24.57 35.02,24.18 34.38,24.18 v34.2,24
  Bottom 0.152: U$15.7 41.44,44.97 v41.8,44.6 | v34.2,24 33.8,23.6 33.8,23.58 U$17.3 | U$17.3
SG1-1  (via drill 0.35)
  Top 0.152: v18.4,26.8 18.4,26.81 17.64,27.57 17.64,28.03 17.95,28.33 17.95,29.78 16.74,30.99 16.74,32.25 17.96,33.47 17.96,34.43 17.94,34.44 17.94,37.26 v16.2,39
  Bottom 0.152: U$9.6 16.77,39.56 v16.2,39 | 25.01,14.79 U$17.31 25.01,14.79 | 25.01,14.79 24.02,13.8 22.2,13.8 18.4,17.6 v18.4,26.8 | 25.01,14.79
SG1-2  (via drill 0.35)
  Top 0.152: v47,39.6 48.21,39.6 48.77,40.16 49.23,40.16 49.56,39.83 49.56,39.37 49.25,39.07 49.25,37.77 47.34,35.86 47.34,35.84 44.4,32.89 44.02,32.89 43.92,32.79 43.92,31.77 43.8,31.65 43.8,31.6 38.2,26 38.2,24.64 38,24.43 38,24.38 35.94,24.38 33.4,21.84 v33.4,20.8
  Bottom 0.152: U$16.6 47.37,39.97 v47,39.6 | U$17.5 34.3,21.7 v33.4,20.8 | U$17.5
SG2-1  (via drill 0.35)
  Top 0.152: v18.6,39 18.2,38.6 18.2,34.55 18.21,34.54 18.21,33.37 16.99,32.15 16.99,31.1 18.2,29.89 v18.2,27.8
  Bottom 0.152: 35.26,13.86 U$17.16 35.26,13.86 | 35.26,13.86 34.91,14.2 33.91,14.2 | 33.91,14.2 30.5,10.8 30.5,7.42 29.21,6.13 29.21,3.73 27.59,2.11 24.83,2.11 24.25,2.69 24.25,3.5 22.7,5.05 9.85,5.05 8.4,3.6 8.4,2.4 ICSP.5 | U$9.7 18.04,39.56 v18.6,39 | 33.91,14.2 30.16,14.2 30.11,14.25 26.92,14.25 24.34,16.83 23.17,16.83 18.65,21.35 18.65,26.27 18.96,26.57 18.96,27.03 18.63,27.36 18.44,27.36 18.2,27.6 v18.2,27.8 | 35.26,13.86
SG2-2  (via drill 0.35)
  Top 0.152: v49,39.6 49,37.87 44.27,33.15 43.92,33.15 43.66,32.89 43.66,31.88 37.95,26.16 37.95,24.74 37.84,24.64 35.84,24.64 32.6,21.4 v32.4,21.4
  Bottom 0.152: U$16.7 48.63,39.97 v49,39.6 | v32.4,21.4 32.74,21.4 U$17.4 | U$17.4
TX
  Bottom 0.152: JP3.1 29.56,30.51 29.56,26.2 28.8,25.44 28.8,24.84 U$17.44

### Text on the board
tPlace: D1 | S7S | D2 | S7S | PWR | sjm4306
bPlace: o | o | + | + | o | o | o | o | o | o | EasyFlip v2.0 | Test | TX | Serial | RX | o | o | o | gnd | o | o | o | PIC16F887 | D3 | D2 | D1 | 5V | 12V | gnd | 5V | 12V | gnd | > | PWR | sjm4306 121218